# Altium schematic sheet USB.SchDoc
size A
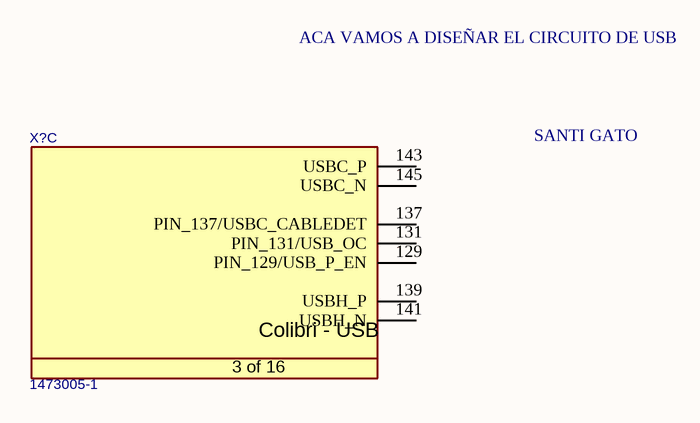
[diagram p0: USB.SchDoc]

## Parts
X?  Manufacturer Part No.: 1473005-1  [T_Tyco_1473005-1]  (hidden comment: CON-Tyco-1473005-1-200-0.6mm)  (part C of 16)

## Nets

Not connected (* = marked no-connect by the designer): X? 129(PIN_129/USB_P_EN) 131(PIN_131/USB_OC) 137(PIN_137/USBC_CABLEDET) 139(USBH_P) 141(USBH_N) 143(USBC_P) 145(USBC_N)

## Notes on the sheet
- ACA VAMOS A DISEÑAR EL CIRCUITO DE USB
- SANTI GATO
- (in symbol CON-Tyco-1473005-1-200-0.6mm, part C) Colibri - USB; 3 of 16

## Library data of the parts
X? = CON-Tyco-1473005-1-200-0.6mm: SODIMM Connector; Manufacturer Name: Tyco; No. of ways: 200